# Altium project FIT_TCM.PrjPcb (part 4 of 9)

## Sheet FIT_TCM_P1V8.SchDoc: FIT_PM12 board
size 420 x 297 mm; CheckedBy: G.Kasprowicz; Author: INR Moscow; CompanyName: WUT ISE; DrawnBy: M.Podgórski; Organization: WUT ISE; Address1: PW ISE; Address2: Nowowiejska 15/19 00-665 Warsaw; Address3: gkasprow@gmail.com; Revision: 2; SheetNumber: -; SheetTotal: -; ModifiedBy: -; CheckedDate: -; Title2: Title 2; DivGrp: WUT ISE; Designer: INR RAS; ModifiedDate: -; ProjectName: Sensor Box
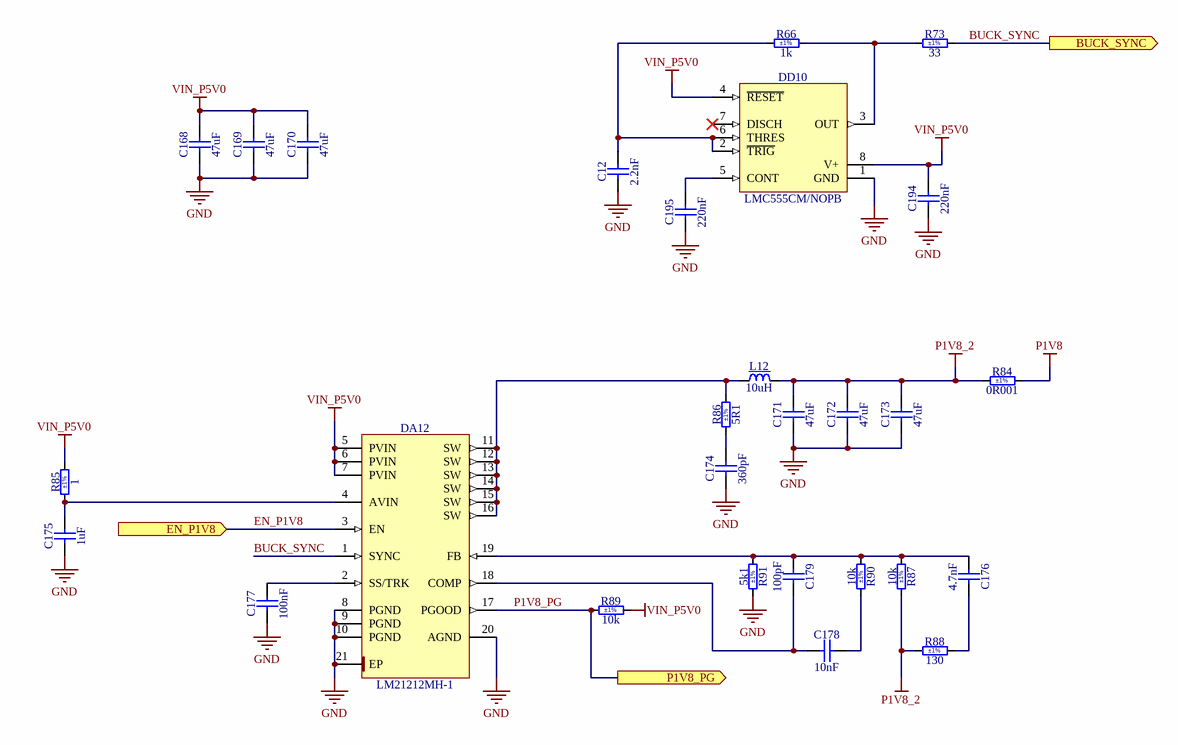
[diagram p9: FIT_TCM_P1V8.SchDoc]

### Parts
C12  2.2nF  [CAPC2013X100N]
C168  47uF  [CAPC3225X270N]
C169  47uF  [CAPC3225X270N]
C170  47uF  [CAPC3225X270N]
C171  47uF  [CAPC3225X270N]
C172  47uF  [CAPC3225X270N]
C173  47uF  [CAPC3225X270N]
C174  360pF  [CAPC2013X145N]
C175  1uF  [CAPC2012X140N]
C176  4.7nF  [CAPC2012X95N]
C177  100nF  [CAPC2012X135N]
C178  10nF  [CAPC2012X135N]
C179  100pF  [CAPC2012X135N]
C194  220nF  [CAPC2012X135N]
C195  220nF  [CAPC2012X135N]
DA12  LM21212MH-1  [TEXAS_PWP0020AA]
DD10  LMC555CM/NOPB  [SOIC127P600X175-8N]
L12  10uH  [IND_VISHAY_IHPL4040DZ-01]
R66  1k  Tolerance: ±1%  [RESC2012X60N]
R73  33  Tolerance: ±1%  [RESC2012X60N]
R84  0R001  Tolerance: ±1%  [RESC_BOURNS_CRE2512_0R001-0R004]
R85  1  Tolerance: ±1%  [RESC2012X60N]
R86  5R1  Tolerance: ±1%  [RESC2012X60N]
R87  10k  Tolerance: ±1%  [RESC2012X60N]
R88  130  Tolerance: ±1%  [RESC2012X60N]
R89  10k  Tolerance: ±1%  [RESC2012X60N]
R90  10k  Tolerance: ±1%  [RESC2012X60N]
R91  5k1  Tolerance: ±1%  [RESC2012X60N]

### Ports
BUCK_SYNC (out), EN_P1V8 (in), P1V8_PG (out)

### Nets
GND: C12.1 C168.1 C169.1 C170.1 C171.1 C172.1 C173.1 C174.1 C175.1 C177.1 C194.1 C195.1 DA12.8(PGND) DA12.9(PGND) DA12.10(PGND) DA12.20(AGND) DA12.21(EP) DD10.1(GND) R91.1
P1V8: R84.2
P1V8_2: C171.2 C172.2 C173.2 L12.2 R84.1 R87.1 R88.2
VIN_P5V0: C168.2 C169.2 C170.2 C194.2 DA12.5(PVIN) DA12.6(PVIN) DA12.7(PVIN) DD10.4(~{RESET}) DD10.8(V+) R85.2 R89.2
BUCK_SYNC: DA12.1(SYNC) R73.2 ; port BUCK_SYNC
EN_P1V8: DA12.3(EN) ; port EN_P1V8
P1V8_PG: DA12.17(PGOOD) R89.1 ; port P1V8_PG
NetC12_2: C12.2 DD10.2(~{TRIG}) DD10.6(THRES) R66.1
NetC174_2: C174.2 R86.1
NetC175_2: C175.2 DA12.4(AVIN) R85.1
NetC176_1: C176.1 R88.1
NetC176_2: C176.2 C179.2 DA12.19(FB) R87.2 R90.2 R91.2
NetC177_2: C177.2 DA12.2(SS/TRK)
NetC178_1: C178.1 R90.1
NetC178_2: C178.2 C179.1 DA12.18(COMP)
NetC195_2: C195.2 DD10.5(CONT)
NetDA12_11: DA12.11(SW) DA12.12(SW) DA12.13(SW) DA12.14(SW) DA12.15(SW) DA12.16(SW) L12.1 R86.2
NetDD10_3: DD10.3(OUT) R66.2 R73.1

Not connected (* = marked no-connect by the designer): DD10 7(DISCH)*

### Notes on the sheet
- Project/Equipment
- Document
- Designer
- Drawn by
- Check.by
- Copyright WUT ISE 2024.
  This documentation describes Open Hardware and is licensed under the CERN OHL v.2. You may redistribute and modify this documentation under the terms of the CERN OHL v.2. (http://ohwr.org/CERNOHL). This documentation is distributed WITHOUT ANY EXPRESS OR IMPLIED WARRANTY, INCLUDING OF MERCHANTABILITY, SATISFACTORY QUALITY AND FITNESS FOR A PARTICULAR PURPOSE. Please see the CERN OHL v.2 for applicable conditions.
- Contact
- File
- Last Mod.
- Print Date
- Sheet
- Size
- A3
- of
- Rev

### Library data of the parts
C12 = CC0805_2.2NF_50V_5%_C0G: Non-polarised capacitor; Part Description: SMD Multilayer Chip Ceramic Capacitor; Manufacturer: GENERIC; Manufacturer1 Part Number: C0805C222J5GACTU; Voltage: 50V; TC: C0G/NP0; Tolerance: ±5%; Part Number: CC0805_2.2NF_50V_5%_C0G; Component Kind: Standard; Component Type: Standard; Pin Count: 2; Value: 2.2nF; Status: None; Manufacturer Part Number: CC0805_2.2NF_50V_5%_C0G; Case: 0805; Mounted: Yes; Socket: No; SMD: Yes; Sense: No; Manufacturer1 Example: KEMET; Manufacturer1 ComponentHeight: 0.88mm; HelpURL: \\cern.ch\dfs\Applications\Altium\Datasheets\CC0805_C0G_KEMET_(Commercial Grade).pdf; Author: CERN DEM MR; CreateDate: 26.01.2016; LatestRevisionDate: 26.01.2016
C168-C173 = CC1210_47UF_16V_20%_X5R: Non-polarised capacitor; Part Description: SMD Multilayer Chip Ceramic Capacitor; Manufacturer: GENERIC; Manufacturer1 Part Number: EMK325BJ476MM-T; Voltage: 16V; TC: X5R; Tolerance: ±20%; Part Number: CC1210_47UF_16V_20%_X5R; Component Kind: Standard; Component Type: Standard; Pin Count: 2; Value: 47uF; Status: None; Manufacturer Part Number: CC1210_47UF_16V_20%_X5R; Case: 1210; Mounted: Yes; Socket: No; SMD: Yes; Sense: No; Manufacturer1 Example: TAIYO YUDEN; Manufacturer1 ComponentHeight: 2.7mm; HelpURL: \\cern.ch\dfs\Applications\Altium\Datasheets\CC1210_X5R_TAIYO-YUDEN_HIGH-VALUE.pdf; Author: CERN DEM MR; CreateDate: 03.02.2016; LatestRevisionDate: 03.02.2016
C174 = CC0805_360PF_50V_5%_C0G: Non-polarised capacitor; Part Description: SMD Multilayer Chip Ceramic Capacitor; Manufacturer: GENERIC; Manufacturer1 Part Number: CC0805JRNPO9BN361; Voltage: 50V; TC: NP0; Tolerance: ±5%; Part Number: CC0805_360PF_50V_5%_C0G; Component Kind: Standard; Component Type: Standard; Pin Count: 2; Value: 360pF; Status: None; Manufacturer Part Number: CC0805_360PF_50V_5%_C0G; Case: 0805; Mounted: Yes; Socket: No; SMD: Yes; Sense: No; Manufacturer1 Example: YAGEO PHYCOMP; Manufacturer1 ComponentHeight: 1.45mm; HelpURL: \\cern.ch\dfs\Applications\Altium\Datasheets\CC0805_NP0_YAGEO.pdf; Author: CERN DEM HF; CreateDate: 30.05.2024; LatestRevisionDate: 30.05.2024
C175 = CC0805_1UF_25V_10%_X7R: Non-polarised capacitor; Part Description: SMD Multilayer Chip Ceramic Capacitor; Manufacturer: GENERIC; Manufacturer1 Part Number: C0805C105K3RAC; Voltage: 25V; TC: X7R; Tolerance: ±10%; Part Number: CC0805_1UF_25V_10%_X7R; Component Kind: Standard; Component Type: Standard; Pin Count: 2; Value: 1uF; Status: Preferred; Manufacturer Part Number: CC0805_1UF_25V_10%_X7R; Case: 0805; Mounted: Yes; Socket: No; SMD: Yes; Sense: No; Manufacturer1 Example: KEMET; Manufacturer1 ComponentHeight: 1.4mm; HelpURL: \\cern.ch\dfs\Applications\Altium\Datasheets\CC0805_X7R_KEMET.pdf; Author: CERN DEM JLC; CreateDate: 23.03.2009; LatestRevisionDate: 23.03.2009
C176 = CC0805_4.7NF_50V_5%_NP0: Non-polarised capacitor; Part Description: SMD Multilayer Chip Ceramic Capacitor; Manufacturer: GENERIC; Manufacturer1 Part Number: GRM2195C1H472JA01; Voltage: 50V; TC: C0G/NP0; Tolerance: ±5%; Part Number: CC0805_4.7NF_50V_5%_NP0; Component Kind: Standard; Component Type: Standard; Pin Count: 2; Value: 4.7nF; Status: None; Manufacturer Part Number: CC0805_4.7NF_50V_5%_NP0; Case: 0805; Mounted: Yes; Socket: No; SMD: Yes; Sense: No; Manufacturer1 Example: MURATA; Manufacturer1 ComponentHeight: 0.95mm; HelpURL: \\cern.ch\dfs\Applications\Altium\Datasheets\CC0805_MURATA_GRM2195C1H472JA01.pdf; Author: CERN DEM MR; CreateDate: 30.03.2016; LatestRevisionDate: 30.03.2016
C177 = CC0805_100NF_50V_10%_X7R: Non-polarised capacitor; Part Description: SMD Multilayer Chip Ceramic Capacitor; Manufacturer: GENERIC; Manufacturer1 Part Number: C2012X7R1H104K085; Voltage: 50V; TC: X7R; Tolerance: ±10%; Part Number: CC0805_100NF_50V_10%_X7R; Component Kind: Standard; Component Type: Standard; Pin Count: 2; Value: 100nF; Status: None; Manufacturer Part Number: CC0805_100NF_50V_10%_X7R; Case: 0805; Mounted: Yes; Socket: No; SMD: Yes; Sense: No; Manufacturer1 Example: TDK; Manufacturer1 ComponentHeight: 1mm; HelpURL: \\cern.ch\dfs\Applications\Altium\Datasheets\CC0805_X7R_TDK_C.pdf; Author: CERN DEM JLC; CreateDate: 03.12.2007; LatestRevisionDate: 22.04.2015
C178 = CC0805_10NF_50V_10%_X7R: Non-polarised capacitor; Part Description: SMD Multilayer Chip Ceramic Capacitor; Manufacturer: GENERIC; Manufacturer1 Part Number: C0805C103K5RACTU; Voltage: 50V; TC: X7R; Tolerance: ±10%; Part Number: CC0805_10NF_50V_10%_X7R; Component Kind: Standard; Component Type: Standard; Pin Count: 2; Value: 10nF; Status: Preferred; Manufacturer Part Number: CC0805_10NF_50V_10%_X7R; Case: 0805; Mounted: Yes; Socket: No; SMD: Yes; Sense: No; Manufacturer1 Example: KEMET; Manufacturer1 ComponentHeight: 0.88mm; HelpURL: \\cern.ch\dfs\Applications\Altium\Datasheets\CC0805_X7R_KEMET.pdf; Author: CERN DEM JLC; CreateDate: 03.12.2007; LatestRevisionDate: 22.04.2015
C179 = CC0805_100PF_50V_5%_NP0: Non-polarised capacitor; Part Description: SMD Multilayer Chip Ceramic Capacitor; Manufacturer: GENERIC; Manufacturer1 Part Number: 223886115101; Voltage: 50V; TC: C0G/NP0; Tolerance: ±5%; Part Number: CC0805_100PF_50V_5%_NP0; Component Kind: Standard; Component Type: Standard; Pin Count: 2; Value: 100pF; Status: Preferred; Manufacturer Part Number: CC0805_100PF_50V_5%_NP0; Case: 0805; Mounted: Yes; Socket: No; SMD: Yes; Sense: No; Manufacturer1 Example: PHYCOMP; Manufacturer1 ComponentHeight: 1.35mm; HelpURL: \\cern.ch\dfs\Applications\Altium\Datasheets\CC0805_NP0_PHYCOMP.pdf; Author: CERN DEM JLC; CreateDate: 03.12.2007; LatestRevisionDate: 03.12.2007
C194 C195 = CC0805_220NF_50V_10%_X7R: as C31-C35 on sheet FIT_TCM_SI5338A; Part Number: CC0805_220NF_50V_10%_X7R; Component Kind: Standard; Component Type: Standard; Pin Count: 2; Value: 220nF; Status: Preferred; Manufacturer Part Number: CC0805_220NF_50V_10%_X7R; Case: 0805; Mounted: Yes; Socket: No; SMD: Yes; Sense: No; Manufacturer1 Example: MURATA; Manufacturer1 ComponentHeight: 1.35mm; HelpURL: \\cern.ch\dfs\Applications\Altium\Datasheets\CC0805_X7R_MURATA.pdf; Author: CERN DEM JLC; CreateDate: 03.12.2007; LatestRevisionDate: 03.12.2007
DA12 = LM21212MH-1: 2.95-V To 5.5-V, 12-A, Voltage-Mode Synchronous Buck Regulator with Frequency Synchronization; Manufacturer: TEXAS INSTRUMENTS; PressFit: No; Bonding: No; Part Number: LM21212MH-1; Component Kind: Standard; Component Type: Standard; Device: LM21212MH-1; PackageDescription: TEXAS Case Style PWP0020AA, SOP, 0.65mm Pitch; 20 Pin, 4.40mm W X 6.50mm L X 1.10mm H body (w/thermal tab 3.4mm X 4.6mm  ), IPC Medium Density; Part Description: 2.95-V To 5.5-V, 12-A, Voltage-Mode Synchronous Buck Regulator with Frequency Synchronization; Manufacturer Part Number: LM21212MH-1; Pin Count: 21; Case: TSSOP20; Mounted: Yes; Socket: No; SMD: Yes; Sense: No; ComponentHeight: 1.1mm; HelpURL: \\cern.ch\dfs\Applications\Altium\Datasheets\LM21212MH-1.pdf; Author: CERN DEM HF; CreateDate: 05.06.2024; LatestRevisionDate: 05.06.2024
DD10 = LMC555CM/NOPB: CMOS Timer; Manufacturer: NATIONAL SEMICONDUCTOR; PressFit: No; Bonding: No; Part Number: LMC555CM/NOPB; Component Kind: Standard; Component Type: Standard; Device: LMC555CM/NOPB; PackageDescription: SOIC 8, Pitch 1.27mm, Body 4x5mm, IPC Medium Density; Part Description: CMOS Timer; Manufacturer Part Number: LMC555CM; Pin Count: 8; Case: SOIC8; Mounted: Yes; Socket: No; SMD: Yes; Sense: No; ComponentHeight: 1.75mm; Author: CERN DEM JLC; HelpURL: \\cern.ch\dfs\Applications\Altium\Datasheets\LMC555C-NOPB.pdf; CreateDate: 12.04.2010; LatestRevisionDate: 01.06.2022
L12 = IND4040_10UH_20%_VISHAY_IHLP-4040DZ-01: Inductor With Core; Part Description: IHLP® Commercial Inductor, Low DCR Series; Manufacturer: VISHAY DALE; Manufacturer Part Number: IHLP4040DZER100M01; Power: 6.8A; Resistance: 0.0332R; Tolerance: ±20%; Part Number: IND4040_10UH_20%_VISHAY_IHLP-4040DZ-01; Component Kind: Standard; Component Type: Standard; Pin Count: 2; Value: 10uH; Case: 4040; Mounted: Yes; Socket: No; SMD: Yes; Sense: No; ComponentHeight: 4mm; HelpURL: \\cern.ch\dfs\Applications\Altium\Datasheets\IND_VISHAY_IHLP4040DZ-01.pdf; Author: CERN DEM HF; CreateDate: 31.05.2024; LatestRevisionDate: 31.05.2024
R66 = R0805_1K_1%_0.125W_100PPM: Resistor - 1%; Part Description: General Purpose Thick Film Chip Resistor; Manufacturer: GENERIC; Manufacturer1 Part Number: NRC10F1001TRF; Power: 0.125W; TC: ±100ppm/°C; PressFit: No; Part Number: R0805_1K_1%_0.125W_100PPM; Component Kind: Standard; Component Type: Standard; Pin Count: 2; Value: 1k; Status: Preferred; Manufacturer Part Number: R0805_1K_1%_0.125W_100PPM; Case: 0805; Mounted: Yes; Sense: No; Socket: No; SMD: Yes; Manufacturer1 Example: NIC COMPONENT; Manufacturer1 ComponentHeight: 0.6mm; HelpURL: \\cern.ch\dfs\Applications\Altium\Datasheets\R0805_NIC_NRC.pdf; Author: CERN DEM JLC; CreateDate: 03.12.2007; LatestRevisionDate: 13.03.2008
R73 = R0805_33R_1%_0.125W_100PPM: Resistor - 1%; Part Description: General Purpose Thick Film Chip Resistor; Manufacturer: GENERIC; Manufacturer1 Part Number: NRC10F33R0TRF; Power: 0.125W; TC: ±100ppm/°C; PressFit: No; Part Number: R0805_33R_1%_0.125W_100PPM; Component Kind: Standard; Component Type: Standard; Pin Count: 2; Value: 33; Status: Preferred; Manufacturer Part Number: R0805_33R_1%_0.125W_100PPM; Case: 0805; Mounted: Yes; Sense: No; Socket: No; SMD: Yes; Manufacturer1 Example: NIC COMPONENT; Manufacturer1 ComponentHeight: 0.6mm; HelpURL: \\cern.ch\dfs\Applications\Altium\Datasheets\R0805_NIC_NRC.pdf; Author: CERN DEM JLC; CreateDate: 03.12.2007; LatestRevisionDate: 13.03.2008
R84 = R2512_0R001_1%_3W_50PPM_BOURNS_CRE2512: Resistor - 1%; Part Description: High Power Current Sense Chip Resistor; Manufacturer: BOURNS; Manufacturer Part Number: CRE2512-FZ-R001E-3; Power: 3W; TC: ±50ppm/°C; PressFit: No; Part Number: R2512_0R001_1%_3W_50PPM_BOURNS_CRE2512; Component Kind: Standard; Component Type: Standard; Pin Count: 2; Value: 0R001; Status: None; Case: 2512; Mounted: Yes; Sense: No; Socket: No; SMD: Yes; ComponentHeight: 0.9mm; HelpURL: \\cern.ch\dfs\Applications\Altium\Datasheets\R2512_BOURNS_CRE2512.pdf; Author: CERN DEM BC; CreateDate: 13.10.2021; LatestRevisionDate: 13.10.2021
R85 = R0805_1R_1%_0.125W_100PPM: Resistor - 1%; Part Description: Thick Film Chip Resistor; Manufacturer: GENERIC; Manufacturer1 Part Number: CRCW08051R00FKEA; Power: 0.125W; TC: ±100ppm/°C; PressFit: No; Part Number: R0805_1R_1%_0.125W_100PPM; Component Kind: Standard; Component Type: Standard; Pin Count: 2; Value: 1; Status: None; Manufacturer Part Number: R0805_1R_1%_0.125W_100PPM; Case: 0805; Mounted: Yes; Sense: No; Socket: No; SMD: Yes; Manufacturer1 Example: VISHAY; Manufacturer1 ComponentHeight: 0.6mm; HelpURL: \\cern.ch\dfs\Applications\Altium\Datasheets\R0805_VISHAY_CRCW e3.pdf; Author: CERN DEM HF; CreateDate: 07.06.2024; LatestRevisionDate: 07.06.2024
R86 = R0805_5R1_1%_0.125W_100PPM: Resistor - 1%; Part Description: Thick Film Chip Resistor; Manufacturer: GENERIC; Manufacturer1 Part Number: CRCW08055R10FKEAHP; Power: 0.125W; TC: ±100ppm/°C; PressFit: No; Part Number: R0805_5R1_1%_0.125W_100PPM; Component Kind: Standard; Component Type: Standard; Pin Count: 2; Value: 5R1; Status: None; Manufacturer Part Number: R0805_5R1_1%_0.125W_100PPM; Case: 0805; Mounted: Yes; Sense: No; Socket: No; SMD: Yes; Manufacturer1 Example: VISHAY; Manufacturer1 ComponentHeight: 0.6mm; HelpURL: \\cern.ch\dfs\Applications\Altium\Datasheets\R0805_VISHAY_CRCW-HP e3.pdf; Author: CERN DEM HF; CreateDate: 07.06.2024; LatestRevisionDate: 07.06.2024
R87 R89 R90 = R0805_10K_1%_0.125W_100PPM: Resistor - 1%; Part Description: General Purpose Thick Film Chip Resistor; Manufacturer: GENERIC; Manufacturer1 Part Number: NRC10F1002TRF; Power: 0.125W; TC: ±100ppm/°C; PressFit: No; Part Number: R0805_10K_1%_0.125W_100PPM; Component Kind: Standard; Component Type: Standard; Pin Count: 2; Value: 10k; Status: Preferred; Manufacturer Part Number: R0805_10K_1%_0.125W_100PPM; Case: 0805; Mounted: Yes; Sense: No; Socket: No; SMD: Yes; Manufacturer1 Example: NIC COMPONENT; Manufacturer1 ComponentHeight: 0.6mm; HelpURL: \\cern.ch\dfs\Applications\Altium\Datasheets\R0805_NIC_NRC.pdf; Author: CERN DEM JLC; CreateDate: 03.12.2007; LatestRevisionDate: 13.03.2008
R88 = R0805_130R_1%_0.125W_100PPM: Resistor - 1%; Part Description: General Purpose Thick Film Chip Resistor; Manufacturer: GENERIC; Manufacturer1 Part Number: NRC10F1300TRF; Power: 0.125W; TC: ±100ppm/°C; PressFit: No; Part Number: R0805_130R_1%_0.125W_100PPM; Component Kind: Standard; Component Type: Standard; Pin Count: 2; Value: 130; Status: Preferred; Manufacturer Part Number: R0805_130R_1%_0.125W_100PPM; Case: 0805; Mounted: Yes; Sense: No; Socket: No; SMD: Yes; Manufacturer1 Example: NIC COMPONENT; Manufacturer1 ComponentHeight: 0.6mm; HelpURL: \\cern.ch\dfs\Applications\Altium\Datasheets\R0805_NIC_NRC.pdf; Author: CERN DEM JLC; CreateDate: 03.12.2007; LatestRevisionDate: 13.03.2008
R91 = R0805_5K1_1%_0.125W_100PPM: Resistor - 1%; Part Description: General Purpose Thick Film Chip Resistor; Manufacturer: GENERIC; Manufacturer1 Part Number: NRC10F5101TRF; Power: 0.125W; TC: ±100ppm/°C; PressFit: No; Part Number: R0805_5K1_1%_0.125W_100PPM; Component Kind: Standard; Component Type: Standard; Pin Count: 2; Value: 5k1; Status: Preferred; Manufacturer Part Number: R0805_5K1_1%_0.125W_100PPM; Case: 0805; Mounted: Yes; Sense: No; Socket: No; SMD: Yes; Manufacturer1 Example: NIC COMPONENT; Manufacturer1 ComponentHeight: 0.6mm; HelpURL: \\cern.ch\dfs\Applications\Altium\Datasheets\R0805_NIC_NRC.pdf; Author: CERN DEM JLC; CreateDate: 03.12.2007; LatestRevisionDate: 13.03.2008

## Sheet FIT_TCM_P3V3.SchDoc: FIT_PM12 board
size 420 x 297 mm; CheckedBy: G.Kasprowicz; Author: INR Moscow; CompanyName: WUT ISE; DrawnBy: M.Podgórski; Organization: WUT ISE; Address1: PW ISE; Address2: Nowowiejska 15/19 00-665 Warsaw; Address3: gkasprow@gmail.com; Revision: 2; SheetNumber: -; SheetTotal: -; ModifiedBy: -; CheckedDate: -; Title2: Title 2; DivGrp: WUT ISE; Designer: INR RAS; ModifiedDate: -; ProjectName: Sensor Box
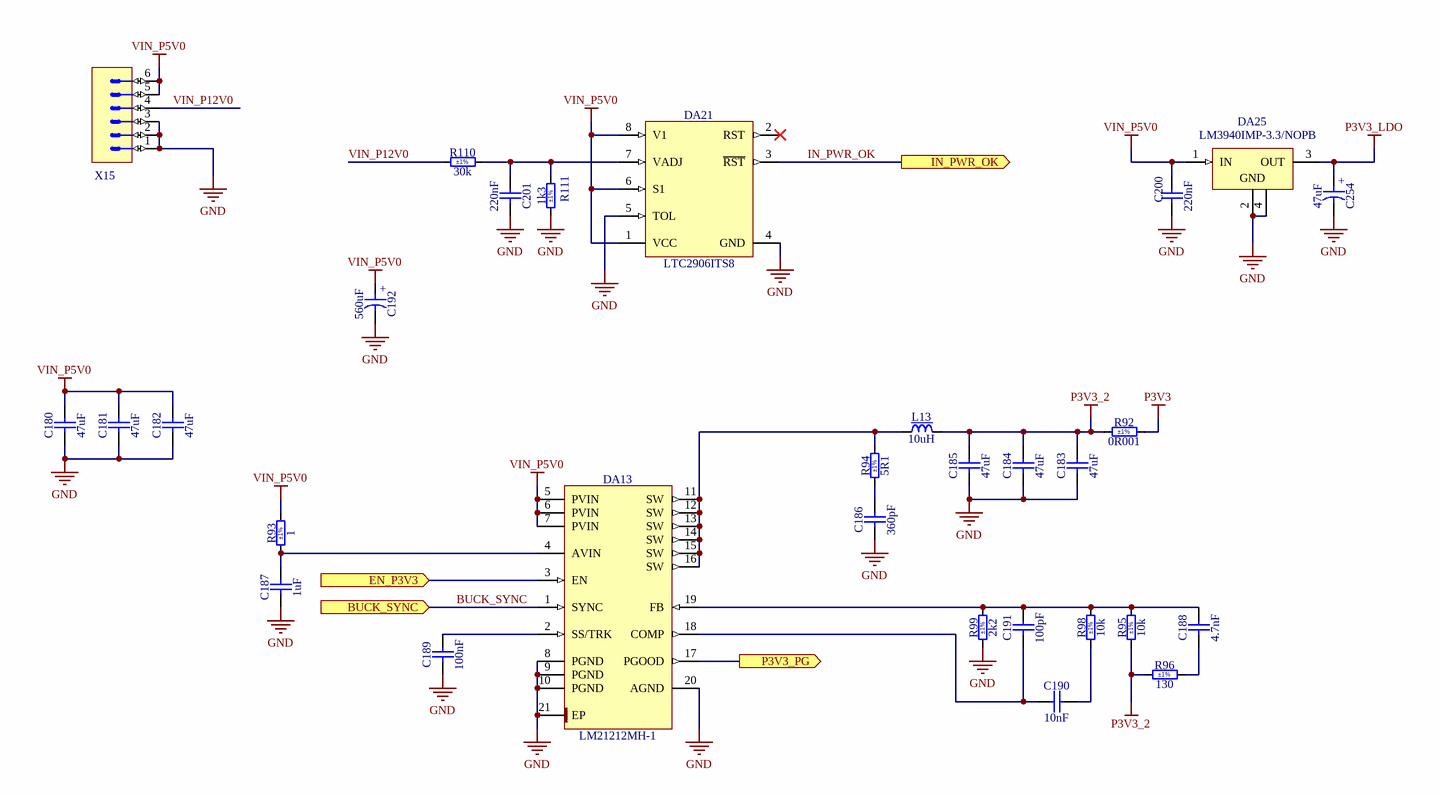
[diagram p10: FIT_TCM_P3V3.SchDoc]

### Parts
C180  47uF  [CAPC3225X270N]
C181  47uF  [CAPC3225X270N]
C182  47uF  [CAPC3225X270N]
C183  47uF  [CAPC3225X270N]
C184  47uF  [CAPC3225X270N]
C185  47uF  [CAPC3225X270N]
C186  360pF  [CAPC2013X145N]
C187  1uF  [CAPC2012X140N]
C188  4.7nF  [CAPC2012X95N]
C189  100nF  [CAPC2012X135N]
C190  10nF  [CAPC2012X135N]
C191  100pF  [CAPC2012X135N]
C192  560uF  [CAPAE830X1020N]
C200  220nF  [CAPC2012X135N]
C201  220nF  [CAPC2012X135N]
C254  47uF  [CAPAE530X610N]
DA13  LM21212MH-1  [TEXAS_PWP0020AA]
DA21  LTC2906ITS8  [SOT65P280X100-8N]
DA25  LM3940IMP-3.3/NOPB  [SOT230P700X180-4N]
L13  10uH  [IND_VISHAY_IHPL4040DZ-01]
R92  0R001  Tolerance: ±1%  [RESC_BOURNS_CRE2512_0R001-0R004]
R93  1  Tolerance: ±1%  [RESC2012X60N]
R94  5R1  Tolerance: ±1%  [RESC2012X60N]
R95  10k  Tolerance: ±1%  [RESC2012X60N]
R96  130  Tolerance: ±1%  [RESC2012X60N]
R98  10k  Tolerance: ±1%  [RESC2012X60N]
R99  2k2  Tolerance: ±1%  [RESC2012X60N]
R110  30k  Tolerance: ±1%  [RESC2012X60N]
R111  1k3  Tolerance: ±1%  [RESC2012X60N]
X15  Mini-Fit BMI  [MOLEX_15-24-9067]  (value not drawn)

### Ports
BUCK_SYNC (in), EN_P3V3 (in), IN_PWR_OK (out), P3V3_PG (out)

### Nets
GND: C180.1 C181.1 C182.1 C183.1 C184.1 C185.1 C186.1 C187.1 C189.1 C192.2 C200.1 C201.1 C254.2 DA13.8(PGND) DA13.9(PGND) DA13.10(PGND) DA13.20(AGND) DA13.21(EP) DA21.4(GND) DA21.5(TOL) DA25.2(GND) DA25.4(GND) R99.1 R111.1 X15.1 X15.2 X15.3
P3V3: R92.2
P3V3_2: C183.2 C184.2 C185.2 L13.2 R92.1 R95.1 R96.2
P3V3_LDO: C254.1 DA25.3(OUT)
VIN_P5V0: C180.2 C181.2 C182.2 C192.1 C200.2 DA13.5(PVIN) DA13.6(PVIN) DA13.7(PVIN) DA21.1(VCC) DA21.6(S1) DA21.8(V1) DA25.1(IN) R93.2 X15.5 X15.6
BUCK_SYNC: DA13.1(SYNC) ; port BUCK_SYNC
EN_P1V0LDO_P3V3: DA13.3(EN) ; port EN_P3V3
IN_PWR_OK: DA21.3(~{RST}) ; port IN_PWR_OK
P1V0LDO_P3V3_PG: DA13.17(PGOOD) ; port P3V3_PG
VIN_P12V0: R110.2 X15.4
NetC186_2: C186.2 R94.1
NetC187_2: C187.2 DA13.4(AVIN) R93.1
NetC188_1: C188.1 R96.1
NetC188_2: C188.2 C191.2 DA13.19(FB) R95.2 R98.2 R99.2
NetC189_2: C189.2 DA13.2(SS/TRK)
NetC190_1: C190.1 R98.1
NetC190_2: C190.2 C191.1 DA13.18(COMP)
NetC201_2: C201.2 DA21.7(VADJ) R110.1 R111.2
NetDA13_11: DA13.11(SW) DA13.12(SW) DA13.13(SW) DA13.14(SW) DA13.15(SW) DA13.16(SW) L13.1 R94.2

Not connected (* = marked no-connect by the designer): DA21 2(RST)*

### Notes on the sheet
- Project/Equipment
- Document
- Designer
- Drawn by
- Check.by
- Copyright WUT ISE 2024.
  This documentation describes Open Hardware and is licensed under the CERN OHL v.2. You may redistribute and modify this documentation under the terms of the CERN OHL v.2. (http://ohwr.org/CERNOHL). This documentation is distributed WITHOUT ANY EXPRESS OR IMPLIED WARRANTY, INCLUDING OF MERCHANTABILITY, SATISFACTORY QUALITY AND FITNESS FOR A PARTICULAR PURPOSE. Please see the CERN OHL v.2 for applicable conditions.
- Contact
- File
- Last Mod.
- Print Date
- Sheet
- Size
- A3
- of
- Rev
- (in symbol CAE530-610_47UF_16V_20%) +
- (in symbol CAE830-1020_560UF_10V_20%) +

### Library data of the parts
C180-C185 = CC1210_47UF_16V_20%_X5R: as C168 on sheet FIT_TCM_P1V8; Part Number: CC1210_47UF_16V_20%_X5R; Component Kind: Standard; Component Type: Standard; Pin Count: 2; Value: 47uF; Status: None; Manufacturer Part Number: CC1210_47UF_16V_20%_X5R; Case: 1210; Mounted: Yes; Socket: No; SMD: Yes; Sense: No; Manufacturer1 Example: TAIYO YUDEN; Manufacturer1 ComponentHeight: 2.7mm; HelpURL: \\cern.ch\dfs\Applications\Altium\Datasheets\CC1210_X5R_TAIYO-YUDEN_HIGH-VALUE.pdf; Author: CERN DEM MR; CreateDate: 03.02.2016; LatestRevisionDate: 03.02.2016
C186 = CC0805_360PF_50V_5%_C0G: as C174 on sheet FIT_TCM_P1V8; Part Number: CC0805_360PF_50V_5%_C0G; Component Kind: Standard; Component Type: Standard; Pin Count: 2; Value: 360pF; Status: None; Manufacturer Part Number: CC0805_360PF_50V_5%_C0G; Case: 0805; Mounted: Yes; Socket: No; SMD: Yes; Sense: No; Manufacturer1 Example: YAGEO PHYCOMP; Manufacturer1 ComponentHeight: 1.45mm; HelpURL: \\cern.ch\dfs\Applications\Altium\Datasheets\CC0805_NP0_YAGEO.pdf; Author: CERN DEM HF; CreateDate: 30.05.2024; LatestRevisionDate: 30.05.2024
C187 = CC0805_1UF_25V_10%_X7R: as C175 on sheet FIT_TCM_P1V8; Part Number: CC0805_1UF_25V_10%_X7R; Component Kind: Standard; Component Type: Standard; Pin Count: 2; Value: 1uF; Status: Preferred; Manufacturer Part Number: CC0805_1UF_25V_10%_X7R; Case: 0805; Mounted: Yes; Socket: No; SMD: Yes; Sense: No; Manufacturer1 Example: KEMET; Manufacturer1 ComponentHeight: 1.4mm; HelpURL: \\cern.ch\dfs\Applications\Altium\Datasheets\CC0805_X7R_KEMET.pdf; Author: CERN DEM JLC; CreateDate: 23.03.2009; LatestRevisionDate: 23.03.2009
C188 = CC0805_4.7NF_50V_5%_NP0: as C176 on sheet FIT_TCM_P1V8; Part Number: CC0805_4.7NF_50V_5%_NP0; Component Kind: Standard; Component Type: Standard; Pin Count: 2; Value: 4.7nF; Status: None; Manufacturer Part Number: CC0805_4.7NF_50V_5%_NP0; Case: 0805; Mounted: Yes; Socket: No; SMD: Yes; Sense: No; Manufacturer1 Example: MURATA; Manufacturer1 ComponentHeight: 0.95mm; HelpURL: \\cern.ch\dfs\Applications\Altium\Datasheets\CC0805_MURATA_GRM2195C1H472JA01.pdf; Author: CERN DEM MR; CreateDate: 30.03.2016; LatestRevisionDate: 30.03.2016
C189 = CC0805_100NF_50V_10%_X7R: as C177 on sheet FIT_TCM_P1V8; Part Number: CC0805_100NF_50V_10%_X7R; Component Kind: Standard; Component Type: Standard; Pin Count: 2; Value: 100nF; Status: None; Manufacturer Part Number: CC0805_100NF_50V_10%_X7R; Case: 0805; Mounted: Yes; Socket: No; SMD: Yes; Sense: No; Manufacturer1 Example: TDK; Manufacturer1 ComponentHeight: 1mm; HelpURL: \\cern.ch\dfs\Applications\Altium\Datasheets\CC0805_X7R_TDK_C.pdf; Author: CERN DEM JLC; CreateDate: 03.12.2007; LatestRevisionDate: 22.04.2015
C190 = CC0805_10NF_50V_10%_X7R: as C178 on sheet FIT_TCM_P1V8; Part Number: CC0805_10NF_50V_10%_X7R; Component Kind: Standard; Component Type: Standard; Pin Count: 2; Value: 10nF; Status: Preferred; Manufacturer Part Number: CC0805_10NF_50V_10%_X7R; Case: 0805; Mounted: Yes; Socket: No; SMD: Yes; Sense: No; Manufacturer1 Example: KEMET; Manufacturer1 ComponentHeight: 0.88mm; HelpURL: \\cern.ch\dfs\Applications\Altium\Datasheets\CC0805_X7R_KEMET.pdf; Author: CERN DEM JLC; CreateDate: 03.12.2007; LatestRevisionDate: 22.04.2015
C191 = CC0805_100PF_50V_5%_NP0: as C179 on sheet FIT_TCM_P1V8; Part Number: CC0805_100PF_50V_5%_NP0; Component Kind: Standard; Component Type: Standard; Pin Count: 2; Value: 100pF; Status: Preferred; Manufacturer Part Number: CC0805_100PF_50V_5%_NP0; Case: 0805; Mounted: Yes; Socket: No; SMD: Yes; Sense: No; Manufacturer1 Example: PHYCOMP; Manufacturer1 ComponentHeight: 1.35mm; HelpURL: \\cern.ch\dfs\Applications\Altium\Datasheets\CC0805_NP0_PHYCOMP.pdf; Author: CERN DEM JLC; CreateDate: 03.12.2007; LatestRevisionDate: 03.12.2007
C192 = CAE830-1020_560UF_10V_20%: Polarised capacitor; Part Description: Aluminum Electrolytic SMT Capacitor; Manufacturer: PANASONIC; Manufacturer Part Number: EEEFH1A561L; Voltage: 10V; Tolerance: ±20%; Part Number: CAE830-1020_560UF_10V_20%; Component Kind: Standard; Component Type: Standard; Pin Count: 2; Value: 560uF; Status: Not Recommended; Case: F; Mounted: Yes; Socket: No; SMD: Yes; Sense: No; ComponentHeight: 10.2mm; HelpURL: \\cern.ch\dfs\Applications\Altium\Datasheets\CAE_PANASONIC_FH.pdf; Author: CERN DEM HF; CreateDate: 24.05.2024; LatestRevisionDate: 24.05.2024
C200 C201 = CC0805_220NF_50V_10%_X7R: as C31-C35 on sheet FIT_TCM_SI5338A; Part Number: CC0805_220NF_50V_10%_X7R; Component Kind: Standard; Component Type: Standard; Pin Count: 2; Value: 220nF; Status: Preferred; Manufacturer Part Number: CC0805_220NF_50V_10%_X7R; Case: 0805; Mounted: Yes; Socket: No; SMD: Yes; Sense: No; Manufacturer1 Example: MURATA; Manufacturer1 ComponentHeight: 1.35mm; HelpURL: \\cern.ch\dfs\Applications\Altium\Datasheets\CC0805_X7R_MURATA.pdf; Author: CERN DEM JLC; CreateDate: 03.12.2007; LatestRevisionDate: 03.12.2007
C254 = CAE530-610_47UF_16V_20%: Polarised capacitor; Part Description: Conductive Polymer Hybrid Aluminum Electrolytic Capacitor; Manufacturer: CHEMI-CON; Manufacturer Part Number: HHXD160ARA470ME61G; Voltage: 16V; Tolerance: ±20%; Part Number: CAE530-610_47UF_16V_20%; Component Kind: Standard; Component Type: Standard; Pin Count: 2; Value: 47uF; Status: Not Recommended; Case: C; Mounted: Yes; Socket: No; SMD: Yes; Sense: No; ComponentHeight: 6.1mm; HelpURL: \\cern.ch\dfs\Applications\Altium\Datasheets\CAE_CHIMI-CON_HXD.pdf; Author: CERN DEM HF; CreateDate: 15.04.2024; LatestRevisionDate: 15.04.2024
DA13 = LM21212MH-1: as DA12 on sheet FIT_TCM_P1V8; Part Number: LM21212MH-1; Component Kind: Standard; Component Type: Standard; Device: LM21212MH-1; PackageDescription: TEXAS Case Style PWP0020AA, SOP, 0.65mm Pitch; 20 Pin, 4.40mm W X 6.50mm L X 1.10mm H body (w/thermal tab 3.4mm X 4.6mm  ), IPC Medium Density; Part Description: 2.95-V To 5.5-V, 12-A, Voltage-Mode Synchronous Buck Regulator with Frequency Synchronization; Manufacturer Part Number: LM21212MH-1; Pin Count: 21; Case: TSSOP20; Mounted: Yes; Socket: No; SMD: Yes; Sense: No; ComponentHeight: 1.1mm; HelpURL: \\cern.ch\dfs\Applications\Altium\Datasheets\LM21212MH-1.pdf; Author: CERN DEM HF; CreateDate: 05.06.2024; LatestRevisionDate: 05.06.2024
DA21 = LTC2906ITS8: Precision Dual Supply Monitors with One Pin-Selectable Threshold and One Adjustable Input; Manufacturer: LINEAR TECHNOLOGY; PressFit: No; Bonding: No; Part Number: LTC2906ITS8; Component Kind: Standard; Component Type: Standard; Device: LTC2906ITS8; PackageDescription: SOT, 0.65mm Pitch; 8 Pin, 1.625mm W X 2.90mm L X 1.00mm H Body, IPC Medium Density; Part Description: Precision Dual Supply Monitors with One Pin-Selectable Threshold and One Adjustable Input; Manufacturer Part Number: LTC2906ITS8; Pin Count: 8; Case: SOT23-8; Mounted: Yes; Socket: No; SMD: Yes; Sense: No; ComponentHeight: 1mm; Author: CERN DEM HF; HelpURL: \\cern.ch\dfs\Applications\Altium\Datasheets\LTC2906.pdf; CreateDate: 05.06.2024; LatestRevisionDate: 05.06.2024
DA25 = LM3940IMP-3.3/NOPB: 3-Terminal Regulator 1=IN 2=GND 3=OUT 4=GND; Part Description: 1A Low Dropout Regulator for 5V to 3.3V Conversion; Manufacturer: TEXAS INSTRUMENTS; PressFit: No; Bonding: No; Part Number: LM3940IMP-3.3/NOPB; Component Kind: Standard; Component Type: Standard; Device: LM3940IMP-3.3/NOPB; PackageDescription: SOT223, 2.30mm Pitch; 4 Pin, 3.70mm W X 6.70mm L X 1.80mm H body, IPC Medium Density; Manufacturer Part Number: LM3940IMP-3.3; Pin Count: 4; Case: SOT223; Mounted: Yes; Socket: No; SMD: Yes; Sense: No; ComponentHeight: 1.8mm; HelpURL: \\cern.ch\dfs\Applications\Altium\Datasheets\LM3940IMP-3.3-NOPB.pdf; Author: CERN DEM JLC; CreateDate: 28.03.2011; LatestRevisionDate: 01.06.2022
L13 = IND4040_10UH_20%_VISHAY_IHLP-4040DZ-01: as L12 on sheet FIT_TCM_P1V8; Part Number: IND4040_10UH_20%_VISHAY_IHLP-4040DZ-01; Component Kind: Standard; Component Type: Standard; Pin Count: 2; Value: 10uH; Case: 4040; Mounted: Yes; Socket: No; SMD: Yes; Sense: No; ComponentHeight: 4mm; HelpURL: \\cern.ch\dfs\Applications\Altium\Datasheets\IND_VISHAY_IHLP4040DZ-01.pdf; Author: CERN DEM HF; CreateDate: 31.05.2024; LatestRevisionDate: 31.05.2024
R92 = R2512_0R001_1%_3W_50PPM_BOURNS_CRE2512: as R84 on sheet FIT_TCM_P1V8; Part Number: R2512_0R001_1%_3W_50PPM_BOURNS_CRE2512; Component Kind: Standard; Component Type: Standard; Pin Count: 2; Value: 0R001; Status: None; Case: 2512; Mounted: Yes; Sense: No; Socket: No; SMD: Yes; ComponentHeight: 0.9mm; HelpURL: \\cern.ch\dfs\Applications\Altium\Datasheets\R2512_BOURNS_CRE2512.pdf; Author: CERN DEM BC; CreateDate: 13.10.2021; LatestRevisionDate: 13.10.2021
R93 = R0805_1R_1%_0.125W_100PPM: as R85 on sheet FIT_TCM_P1V8; Part Number: R0805_1R_1%_0.125W_100PPM; Component Kind: Standard; Component Type: Standard; Pin Count: 2; Value: 1; Status: None; Manufacturer Part Number: R0805_1R_1%_0.125W_100PPM; Case: 0805; Mounted: Yes; Sense: No; Socket: No; SMD: Yes; Manufacturer1 Example: VISHAY; Manufacturer1 ComponentHeight: 0.6mm; HelpURL: \\cern.ch\dfs\Applications\Altium\Datasheets\R0805_VISHAY_CRCW e3.pdf; Author: CERN DEM HF; CreateDate: 07.06.2024; LatestRevisionDate: 07.06.2024
R94 = R0805_5R1_1%_0.125W_100PPM: as R86 on sheet FIT_TCM_P1V8; Part Number: R0805_5R1_1%_0.125W_100PPM; Component Kind: Standard; Component Type: Standard; Pin Count: 2; Value: 5R1; Status: None; Manufacturer Part Number: R0805_5R1_1%_0.125W_100PPM; Case: 0805; Mounted: Yes; Sense: No; Socket: No; SMD: Yes; Manufacturer1 Example: VISHAY; Manufacturer1 ComponentHeight: 0.6mm; HelpURL: \\cern.ch\dfs\Applications\Altium\Datasheets\R0805_VISHAY_CRCW-HP e3.pdf; Author: CERN DEM HF; CreateDate: 07.06.2024; LatestRevisionDate: 07.06.2024
R95 R98 = R0805_10K_1%_0.125W_100PPM: as R87 on sheet FIT_TCM_P1V8; Part Number: R0805_10K_1%_0.125W_100PPM; Component Kind: Standard; Component Type: Standard; Pin Count: 2; Value: 10k; Status: Preferred; Manufacturer Part Number: R0805_10K_1%_0.125W_100PPM; Case: 0805; Mounted: Yes; Sense: No; Socket: No; SMD: Yes; Manufacturer1 Example: NIC COMPONENT; Manufacturer1 ComponentHeight: 0.6mm; HelpURL: \\cern.ch\dfs\Applications\Altium\Datasheets\R0805_NIC_NRC.pdf; Author: CERN DEM JLC; CreateDate: 03.12.2007; LatestRevisionDate: 13.03.2008
R96 = R0805_130R_1%_0.125W_100PPM: as R88 on sheet FIT_TCM_P1V8; Part Number: R0805_130R_1%_0.125W_100PPM; Component Kind: Standard; Component Type: Standard; Pin Count: 2; Value: 130; Status: Preferred; Manufacturer Part Number: R0805_130R_1%_0.125W_100PPM; Case: 0805; Mounted: Yes; Sense: No; Socket: No; SMD: Yes; Manufacturer1 Example: NIC COMPONENT; Manufacturer1 ComponentHeight: 0.6mm; HelpURL: \\cern.ch\dfs\Applications\Altium\Datasheets\R0805_NIC_NRC.pdf; Author: CERN DEM JLC; CreateDate: 03.12.2007; LatestRevisionDate: 13.03.2008
R99 = R0805_2K2_1%_0.125W_100PPM: Resistor - 1%; Part Description: General Purpose Thick Film Chip Resistor; Manufacturer: GENERIC; Manufacturer1 Part Number: NRC10F2201TRF; Power: 0.125W; TC: ±100ppm/°C; PressFit: No; Part Number: R0805_2K2_1%_0.125W_100PPM; Component Kind: Standard; Component Type: Standard; Pin Count: 2; Value: 2k2; Status: Preferred; Manufacturer Part Number: R0805_2K2_1%_0.125W_100PPM; Case: 0805; Mounted: Yes; Sense: No; Socket: No; SMD: Yes; Manufacturer1 Example: NIC COMPONENT; Manufacturer1 ComponentHeight: 0.6mm; HelpURL: \\cern.ch\dfs\Applications\Altium\Datasheets\R0805_NIC_NRC.pdf; Author: CERN DEM JLC; CreateDate: 03.12.2007; LatestRevisionDate: 13.03.2008
R110 = R0805_30K_1%_0.125W_100PPM: Resistor - 1%; Part Description: General Purpose Thick Film Chip Resistor; Manufacturer: GENERIC; Manufacturer1 Part Number: NRC10F3002TRF; Power: 0.125W; TC: ±100ppm/°C; PressFit: No; Part Number: R0805_30K_1%_0.125W_100PPM; Component Kind: Standard; Component Type: Standard; Pin Count: 2; Value: 30k; Status: Preferred; Manufacturer Part Number: R0805_30K_1%_0.125W_100PPM; Case: 0805; Mounted: Yes; Sense: No; Socket: No; SMD: Yes; Manufacturer1 Example: NIC COMPONENT; Manufacturer1 ComponentHeight: 0.6mm; HelpURL: \\cern.ch\dfs\Applications\Altium\Datasheets\R0805_NIC_NRC.pdf; Author: CERN DEM JLC; CreateDate: 03.12.2007; LatestRevisionDate: 13.03.2008
R111 = R0805_1K3_1%_0.125W_100PPM: Resistor - 1%; Part Description: General Purpose Thick Film Chip Resistor; Manufacturer: GENERIC; Manufacturer1 Part Number: NRC10F1301TRF; Power: 0.125W; TC: ±100ppm/°C; PressFit: No; Part Number: R0805_1K3_1%_0.125W_100PPM; Component Kind: Standard; Component Type: Standard; Pin Count: 2; Value: 1k3; Status: Preferred; Manufacturer Part Number: R0805_1K3_1%_0.125W_100PPM; Case: 0805; Mounted: Yes; Sense: No; Socket: No; SMD: Yes; Manufacturer1 Example: NIC COMPONENT; Manufacturer1 ComponentHeight: 0.6mm; HelpURL: \\cern.ch\dfs\Applications\Altium\Datasheets\R0805_NIC_NRC.pdf; Author: CERN DEM JLC; CreateDate: 03.12.2007; LatestRevisionDate: 13.03.2008
X15 = MOLEX_15-24-9067: Connector 6 Male; Part Description: Mini-Fit BMI Header, Dual Row, Right-Angle, with Snap-in Plastic Peg PCB Lock, 6 Circuits, Gold (Au) Plating; Manufacturer: MOLEX; PressFit: No; Part Number: MOLEX_15-24-9067; Component Kind: Standard; Component Type: Standard; Pin Count: 6; Family: Mini-Fit BMI; Mounted: Yes; Socket: No; SMD: No; Sense: No; Status: None; Manufacturer Part Number: 15-24-9067; ComponentHeight: 15mm; HelpURL: \\cern.ch\dfs\Applications\Altium\Datasheets\MOLEX_15-24-9067.pdf; Author: CERN DEM HF; CreateDate: 06.06.2024; LatestRevisionDate: 06.06.2024

## Sheet FIT_TCM_RJ45.SchDoc: FIT_PM12 board
size 420 x 297 mm; CheckedBy: G.Kasprowicz; Author: INR Moscow; CompanyName: WUT ISE; DrawnBy: M.Podgórski; Organization: WUT ISE; Address1: PW ISE; Address2: Nowowiejska 15/19 00-665 Warsaw; Address3: gkasprow@gmail.com; Revision: 2; SheetNumber: -; SheetTotal: -; ModifiedBy: -; CheckedDate: -; Title2: Title 2; DivGrp: WUT ISE; Designer: INR RAS; ModifiedDate: -; ProjectName: Sensor Box
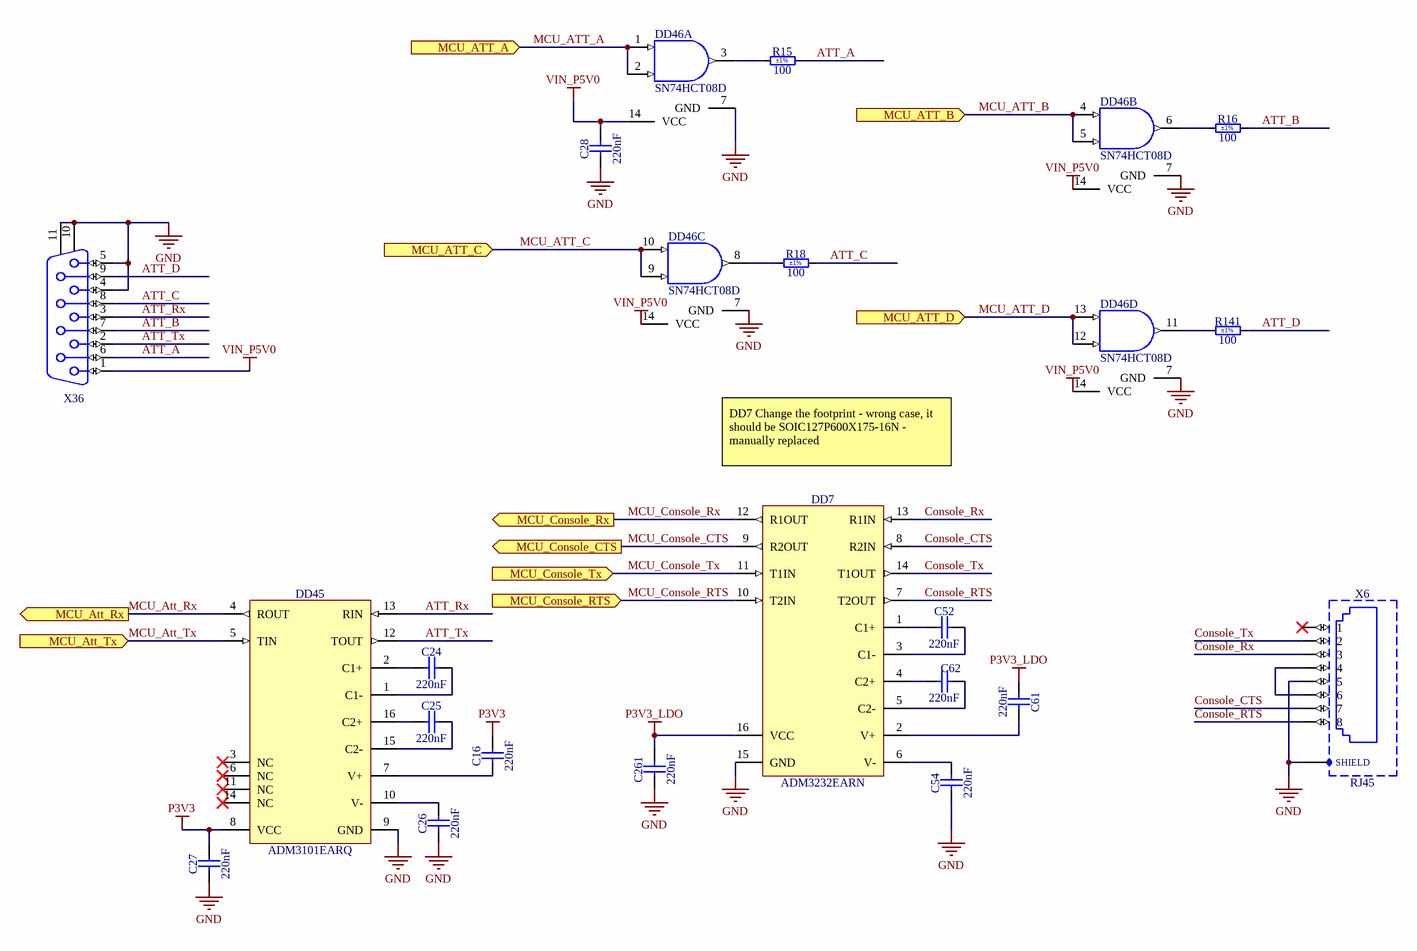
[diagram p11: FIT_TCM_RJ45.SchDoc]

### Parts
C16  220nF  [CAPC2012X135N]
C24  220nF  [CAPC2012X135N]
C25  220nF  [CAPC2012X135N]
C26  220nF  [CAPC2012X135N]
C27  220nF  [CAPC2012X135N]
C28  220nF  [CAPC2012X135N]
C52  220nF  [CAPC2012X135N]
C54  220nF  [CAPC2012X135N]
C61  220nF  [CAPC2012X135N]
C62  220nF  [CAPC2012X135N]
C261  220nF  [CAPC2012X135N]
DD7  ADM3232EARN  [SOIC127P600X175-16N]
DD45  ADM3101EARQ  [SOP63P600X175-16N]
DD46  SN74HCT08D  [SOIC127P600X175-14N]  (parts A,B,C,D of 4)
R15  100  Tolerance: ±1%  [RESC2012X60N]
R16  100  Tolerance: ±1%  [RESC2012X60N]
R18  100  Tolerance: ±1%  [RESC2012X60N]
R141  100  Tolerance: ±1%  [RESC2012X60N]
X6  RJ45  [AMPHENOL_RJLSE4238101]
X36  D-Sub 9F  [HARTING_09 66 152 6612]  (value not drawn)

### Ports
MCU_ATT_A (in), MCU_ATT_B (in), MCU_ATT_C (in), MCU_ATT_D (in), MCU_Att_Rx (out), MCU_Att_Tx (in), MCU_Console_CTS (out), MCU_Console_RTS (in), MCU_Console_Rx (out), MCU_Console_Tx (in)

### Nets
GND: C26.1 C27.1 C28.1 C54.1 C261.1 DD7.15(GND) DD45.9(GND) DD46.7(GND) X6.5 X6.SHIELD X36.4 X36.5 X36.10 X36.11
P3V3: C16.2 C27.2 DD45.8(VCC)
P3V3_LDO: C61.1 C261.2 DD7.16(VCC)
VIN_P5V0: C28.2 DD46.14(VCC) X36.1
ATT_A: R15.2 X36.6
ATT_B: R16.2 X36.7
ATT_C: R18.2 X36.8
ATT_D: R141.2 X36.9
ATT_Rx: DD45.13(RIN) X36.3
ATT_Tx: DD45.12(TOUT) X36.2
Console_CTS: DD7.8(R2IN) X6.7
Console_RTS: DD7.7(T2OUT) X6.8
Console_Rx: DD7.13(R1IN) X6.3
Console_Tx: DD7.14(T1OUT) X6.2
MCU_ATT_A: DD46.1(A) DD46.2(B) ; port MCU_ATT_A
MCU_ATT_B: DD46.4(A) DD46.5(B) ; port MCU_ATT_B
MCU_ATT_C: DD46.9(B) DD46.10(A) ; port MCU_ATT_C
MCU_ATT_D: DD46.12(B) DD46.13(A) ; port MCU_ATT_D
MCU_Att_Rx: DD45.4(ROUT) ; port MCU_Att_Rx
MCU_Att_Tx: DD45.5(TIN) ; port MCU_Att_Tx
MCU_Console_CTS: DD7.9(R2OUT) ; port MCU_Console_CTS
MCU_Console_RTS: DD7.10(T2IN) ; port MCU_Console_RTS
MCU_Console_Rx: DD7.12(R1OUT) ; port MCU_Console_Rx
MCU_Console_Tx: DD7.11(T1IN) ; port MCU_Console_Tx
NetC16_1: C16.1 DD45.7(V+)
NetC24_1: C24.1 DD45.2(C1+)
NetC24_2: C24.2 DD45.1(C1-)
NetC25_1: C25.1 DD45.16(C2+)
NetC25_2: C25.2 DD45.15(C2-)
NetC26_2: C26.2 DD45.10(V-)
NetC52_1: C52.1 DD7.1(C1+)
NetC52_2: C52.2 DD7.3(C1-)
NetC54_2: C54.2 DD7.6(V-)
NetC61_2: C61.2 DD7.2(V+)
NetC62_1: C62.1 DD7.4(C2+)
NetC62_2: C62.2 DD7.5(C2-)
NetDD46_3: DD46.3(Y) R15.1
NetDD46_6: DD46.6(Y) R16.1
NetDD46_8: DD46.8(Y) R18.1
NetDD46_11: DD46.11(Y) R141.1
NetX6_4: X6.4 X6.6

Not connected (* = marked no-connect by the designer): DD45 3(NC)* 6(NC)* 11(NC)* 14(NC)*; X6 1*

### Notes on the sheet
- DD7 Change the footprint - wrong case, it should be SOIC127P600X175-16N - manually replaced
- Project/Equipment
- Document
- Designer
- Drawn by
- Check.by
- Copyright WUT ISE 2024.
  This documentation describes Open Hardware and is licensed under the CERN OHL v.2. You may redistribute and modify this documentation under the terms of the CERN OHL v.2. (http://ohwr.org/CERNOHL). This documentation is distributed WITHOUT ANY EXPRESS OR IMPLIED WARRANTY, INCLUDING OF MERCHANTABILITY, SATISFACTORY QUALITY AND FITNESS FOR A PARTICULAR PURPOSE. Please see the CERN OHL v.2 for applicable conditions.
- Contact
- File
- Last Mod.
- Print Date
- Sheet
- Size
- A3
- of
- Rev

### Library data of the parts
C16 C24-C28 C52 C54 C61 C62 C261 = CC0805_220NF_50V_10%_X7R: as C31-C35 on sheet FIT_TCM_SI5338A; Part Number: CC0805_220NF_50V_10%_X7R; Component Kind: Standard; Component Type: Standard; Pin Count: 2; Value: 220nF; Status: Preferred; Manufacturer Part Number: CC0805_220NF_50V_10%_X7R; Case: 0805; Mounted: Yes; Socket: No; SMD: Yes; Sense: No; Manufacturer1 Example: MURATA; Manufacturer1 ComponentHeight: 1.35mm; HelpURL: \\cern.ch\dfs\Applications\Altium\Datasheets\CC0805_X7R_MURATA.pdf; Author: CERN DEM JLC; CreateDate: 03.12.2007; LatestRevisionDate: 03.12.2007
DD7 = ADM3232EARN: ±15 kV ESD Protected, 3.3 V, RS-232 Line Driver/Receiver; Manufacturer: ANALOG DEVICES; PressFit: No; Bonding: No; Part Number: ADM3232EARN; Component Kind: Standard; Component Type: Standard; Device: ADM3232EARN; Footprint: SOIC127P1032X265-16N; PackageDescription: SOIC, 1.27mm Pitch; 16 pin, 7.50mm W X 10.4mm L X 2.65mm H body, IPC Medium Density; Part Description: ±15 kV ESD Protected, 3.3 V, RS-232 Line Driver/Receiver; Manufacturer Part Number: ADM3232EARN; Pin Count: 16; Case: SOIC16; Mounted: Yes; Socket: No; SMD: Yes; Sense: No; ComponentHeight: 2.65mm; Author: CERN DEM HF; HelpURL: \\cern.ch\dfs\Applications\Altium\Datasheets\ADM3232EARN.pdf; CreateDate: 24.05.2024; LatestRevisionDate: 24.05.2024
DD45 = ADM3101EARQ: ±15 kV ESD Protected, 3.3 V Single-Channel RS-232 Line Driver/Receiver; Manufacturer: ANALOG DEVICES; PressFit: No; Bonding: No; Part Number: ADM3101EARQ; Component Kind: Standard; Component Type: Standard; Device: ADM3101EARQ; PackageDescription: SOP, 0.635mm Pitch; 16 Pin, 3.9mm W X 4.895mm L X 1.75mm H body, IPC Medium Density; Part Description: ±15 kV ESD Protected, 3.3 V Single-Channel RS-232 Line Driver/Receiver; Manufacturer Part Number: ADM3101EARQ; Pin Count: 16; Case: SSOP16; Mounted: Yes; Socket: No; SMD: Yes; Sense: No; ComponentHeight: 1.75mm; Author: CERN DEM HF; HelpURL: \\cern.ch\dfs\Applications\Altium\Datasheets\ADM3101EARQ.pdf; CreateDate: 08.05.2024; LatestRevisionDate: 08.05.2024
DD46 = SN74HCT08D: Quad 2-Input AND Gate; Part Description: Quadruple 2-Input Positive-AND Gate; Manufacturer: TEXAS INSTRUMENTS; PressFit: No; Bonding: No; Part Number: SN74HCT08D; Component Kind: Standard; Component Type: Standard; Device: SN74HCT08D; PackageDescription: SOIC, 1.27mm Pitch; 14 Pin, 4.00mm W X 8.75mm L X 1.75mm H body, IPC Medium Density; Manufacturer Part Number: SN74HCT08D; Pin Count: 14; Case: SOIC14; Mounted: Yes; Socket: No; SMD: Yes; Sense: No; ComponentHeight: 1.75mm; Author: CERN DEM HF; HelpURL: \\cern.ch\dfs\Applications\Altium\Datasheets\SN74HCT08.pdf; CreateDate: 10.06.2024; LatestRevisionDate: 10.06.2024
R15 R16 R18 R141 = R0805_100R_1%_0.125W_100PPM: Resistor - 1%; Part Description: General Purpose Thick Film Chip Resistor; Manufacturer: GENERIC; Manufacturer1 Part Number: NRC10F4700TRF; Power: 0.125W; TC: ±100ppm/°C; PressFit: No; Part Number: R0805_100R_1%_0.125W_100PPM; Component Kind: Standard; Component Type: Standard; Pin Count: 2; Value: 100; Status: Preferred; Manufacturer Part Number: R0805_100R_1%_0.125W_100PPM; Case: 0805; Mounted: Yes; Sense: No; Socket: No; SMD: Yes; Manufacturer1 Example: NIC COMPONENT; Manufacturer1 ComponentHeight: 0.6mm; HelpURL: \\cern.ch\dfs\Applications\Altium\Datasheets\R0805_NIC_NRC.pdf; Author: CERN DEM JLC; CreateDate: 03.12.2007; LatestRevisionDate: 13.03.2008
X6 = AMPHENOL_RJLSE4238101: Connector RJ45 + Shield; Part Description: 1 Port RJ45 Connector, 8P8C ,  Right Angle Without Leds; PressFit: No; Part Number: AMPHENOL_RJLSE4238101; Component Kind: Standard; Component Type: Standard; Pin Count: 9; Family: RJ45; Mounted: Yes; Socket: No; SMD: No; Sense: No; Status: None; Manufacturer: AMPHENOL; Manufacturer Part Number: RJLSE4238101; ComponentHeight: 11.85mm; HelpURL: \\cern.ch\dfs\Applications\Altium\Datasheets\AMPHENOL_RJLSE4238101.pdf; Author: CERN DEM HF; CreateDate: 07.06.2024; LatestRevisionDate: 07.06.2024
X36 = HARTING_09 66 152 6612: Connector D-sub 9 Female; Part Description: Right Angled D-Sub 9 Female Contacts with Grounding Board Locks And UNC 4-40 Flange Thread; PressFit: No; Part Number: HARTING_09 66 152 6612; Component Kind: Standard; Component Type: Standard; Pin Count: 11; Family: D-Sub 9F; Mounted: Yes; Socket: No; SMD: No; Sense: No; Status: None; Manufacturer: HARTING; Manufacturer Part Number: 09 66 152 6612; ComponentHeight: 13.6mm; HelpURL: \\cern.ch\dfs\Applications\Altium\Datasheets\HARTING_09 66 152 6612.pdf; Author: CERN DEM JLC; CreateDate: 16.12.2010; LatestRevisionDate: 08.04.2013

## Sheet FIT_TCM_SFP_PLUS.SchDoc: FIT_PM12 board
size 420 x 297 mm; CheckedBy: G.Kasprowicz; Author: INR Moscow; CompanyName: WUT ISE; DrawnBy: M.Podgórski; Organization: WUT ISE; Address1: PW ISE; Address2: Nowowiejska 15/19 00-665 Warsaw; Address3: gkasprow@gmail.com; Revision: 2; SheetNumber: -; SheetTotal: -; ModifiedBy: -; CheckedDate: -; Title2: Title 2; DivGrp: WUT ISE; Designer: INR RAS; ModifiedDate: -; ProjectName: Sensor Box
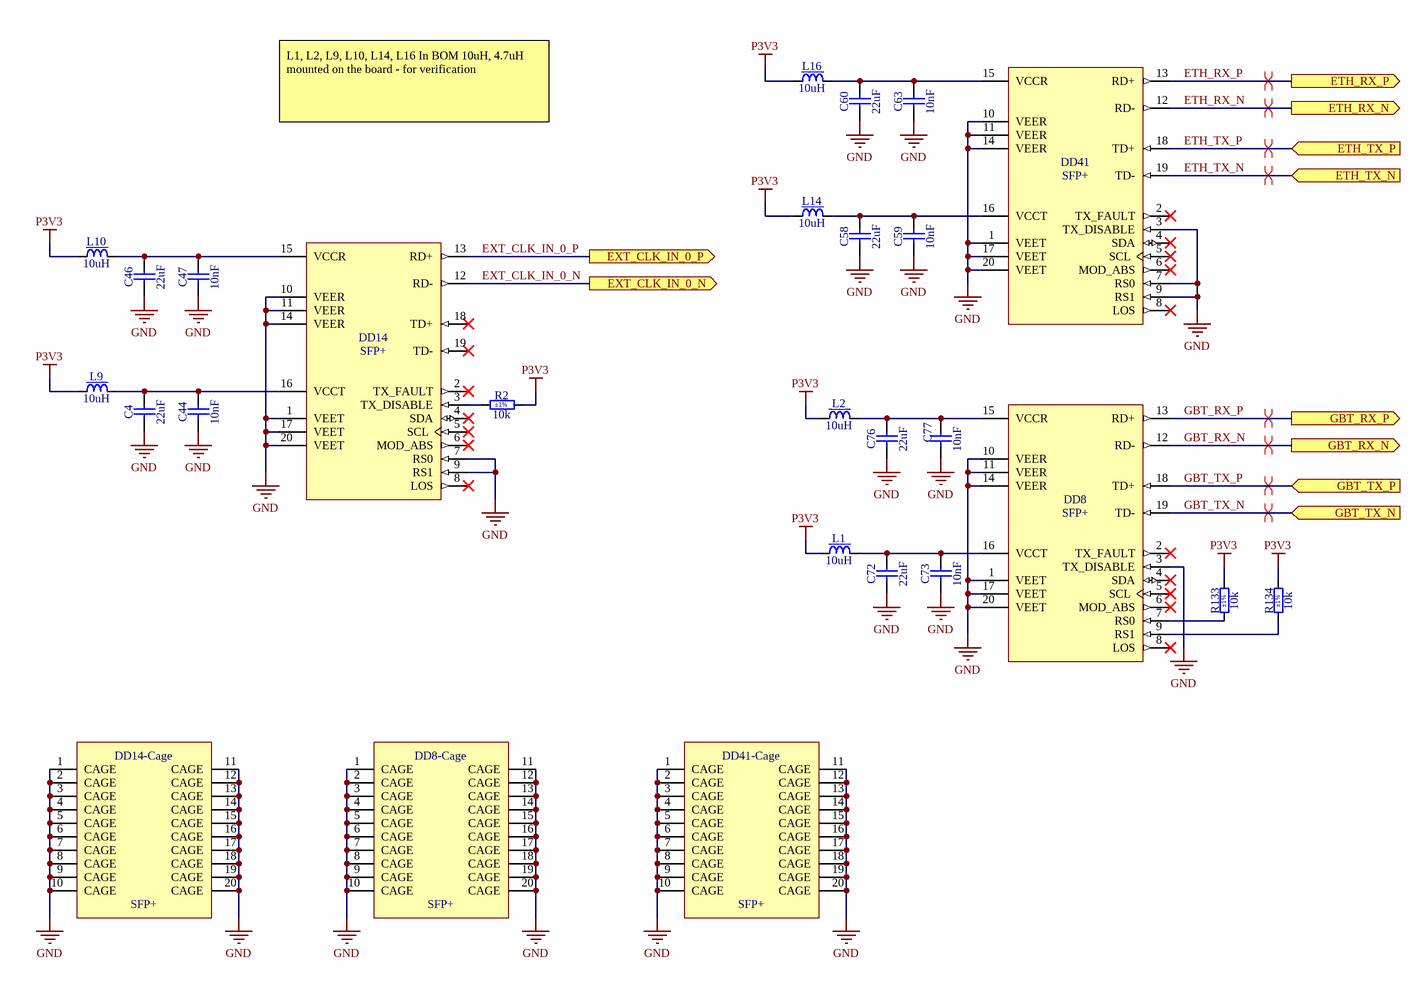
[diagram p12: FIT_TCM_SFP_PLUS.SchDoc]

### Parts
C4  22uF  [CAPC3216X180N]
C44  10nF  [CAPC2012X135N]
C46  22uF  [CAPC3216X180N]
C47  10nF  [CAPC2012X135N]
C58  22uF  [CAPC3216X180N]
C59  10nF  [CAPC2012X135N]
C60  22uF  [CAPC3216X180N]
C63  10nF  [CAPC2012X135N]
C72  22uF  [CAPC3216X180N]
C73  10nF  [CAPC2012X135N]
C76  22uF  [CAPC3216X180N]
C77  10nF  [CAPC2012X135N]
DD8  SFP+  [AMPHENOL_UE76A203000]
DD8-Cage  SFP+  [AMPHENOL_U77A16131001]
DD14  SFP+  [AMPHENOL_UE76A203000]
DD14-Cage  SFP+  [AMPHENOL_U77A16131001]
DD41  SFP+  [AMPHENOL_UE76A203000]
DD41-Cage  SFP+  [AMPHENOL_U77A16131001]
L1  10uH  [INDM5552X200N]
L2  10uH  [INDM5552X200N]
L9  10uH  [INDM5552X200N]
L10  10uH  [INDM5552X200N]
L14  10uH  [INDM5552X200N]
L16  10uH  [INDM5552X200N]
R2  10k  Tolerance: ±1%  [RESC2012X60N]
R133  10k  Tolerance: ±1%  [RESC2012X60N]
R134  10k  Tolerance: ±1%  [RESC2012X60N]

### Ports
ETH_RX_N (out), ETH_RX_P (out), ETH_TX_N (in), ETH_TX_P (in), EXT_CLK_IN_0_N (out), EXT_CLK_IN_0_P (out), GBT_RX_N (out), GBT_RX_P (out), GBT_TX_N (in), GBT_TX_P (in)

### Nets
GND: C4.1 C44.1 C46.1 C47.1 C58.1 C59.1 C60.1 C63.1 C72.1 C73.1 C76.1 C77.1 DD8.1(VEET) DD8.3(TX_DISABLE) DD8.10(VEER) DD8.11(VEER) DD8.14(VEER) DD8.17(VEET) DD8.20(VEET) DD8-Cage.1(CAGE) DD8-Cage.2(CAGE) DD8-Cage.3(CAGE) DD8-Cage.4(CAGE) DD8-Cage.5(CAGE) DD8-Cage.6(CAGE) DD8-Cage.7(CAGE) DD8-Cage.8(CAGE) DD8-Cage.9(CAGE) DD8-Cage.10(CAGE) DD8-Cage.11(CAGE) DD8-Cage.12(CAGE) DD8-Cage.13(CAGE) DD8-Cage.14(CAGE) DD8-Cage.15(CAGE) DD8-Cage.16(CAGE) DD8-Cage.17(CAGE) DD8-Cage.18(CAGE) DD8-Cage.19(CAGE) DD8-Cage.20(CAGE) DD14.1(VEET) DD14.7(RS0) DD14.9(RS1) DD14.10(VEER) DD14.11(VEER) DD14.14(VEER) DD14.17(VEET) DD14.20(VEET) DD14-Cage.1(CAGE) DD14-Cage.2(CAGE) DD14-Cage.3(CAGE) DD14-Cage.4(CAGE) DD14-Cage.5(CAGE) DD14-Cage.6(CAGE) DD14-Cage.7(CAGE) DD14-Cage.8(CAGE) DD14-Cage.9(CAGE) DD14-Cage.10(CAGE) DD14-Cage.11(CAGE) DD14-Cage.12(CAGE) DD14-Cage.13(CAGE) DD14-Cage.14(CAGE) DD14-Cage.15(CAGE) DD14-Cage.16(CAGE) DD14-Cage.17(CAGE) DD14-Cage.18(CAGE) DD14-Cage.19(CAGE) DD14-Cage.20(CAGE) DD41.1(VEET) DD41.3(TX_DISABLE) DD41.7(RS0) DD41.9(RS1) DD41.10(VEER) DD41.11(VEER) DD41.14(VEER) DD41.17(VEET) DD41.20(VEET) DD41-Cage.1(CAGE) DD41-Cage.2(CAGE) DD41-Cage.3(CAGE) DD41-Cage.4(CAGE) DD41-Cage.5(CAGE) DD41-Cage.6(CAGE) DD41-Cage.7(CAGE) DD41-Cage.8(CAGE) DD41-Cage.9(CAGE) DD41-Cage.10(CAGE) DD41-Cage.11(CAGE) DD41-Cage.12(CAGE) DD41-Cage.13(CAGE) DD41-Cage.14(CAGE) DD41-Cage.15(CAGE) DD41-Cage.16(CAGE) DD41-Cage.17(CAGE) DD41-Cage.18(CAGE) DD41-Cage.19(CAGE) DD41-Cage.20(CAGE)
P3V3: L1.1 L2.1 L9.1 L10.1 L14.1 L16.1 R2.2 R133.2 R134.2
ETH_RX_N: DD41.12(RD-) ; port ETH_RX_N
ETH_RX_P: DD41.13(RD+) ; port ETH_RX_P
ETH_TX_N: DD41.19(TD-) ; port ETH_TX_N
ETH_TX_P: DD41.18(TD+) ; port ETH_TX_P
EXT_CLK_IN_0_N: DD14.12(RD-) ; port EXT_CLK_IN_0_N
EXT_CLK_IN_0_P: DD14.13(RD+) ; port EXT_CLK_IN_0_P
GBT_RX_N: DD8.12(RD-) ; port GBT_RX_N
GBT_RX_P: DD8.13(RD+) ; port GBT_RX_P
GBT_TX_N: DD8.19(TD-) ; port GBT_TX_N
GBT_TX_P: DD8.18(TD+) ; port GBT_TX_P
NetC4_2: C4.2 C44.2 DD14.16(VCCT) L9.2
NetC46_2: C46.2 C47.2 DD14.15(VCCR) L10.2
NetC58_2: C58.2 C59.2 DD41.16(VCCT) L14.2
NetC60_2: C60.2 C63.2 DD41.15(VCCR) L16.2
NetC72_2: C72.2 C73.2 DD8.16(VCCT) L1.2
NetC76_2: C76.2 C77.2 DD8.15(VCCR) L2.2
NetDD8_7: DD8.7(RS0) R133.1
NetDD8_9: DD8.9(RS1) R134.1
NetDD14_3: DD14.3(TX_DISABLE) R2.1

Not connected (* = marked no-connect by the designer): DD8 2(TX_FAULT)* 4(SDA)* 5(SCL)* 6(MOD_ABS)* 8(LOS)*; DD14 2(TX_FAULT)* 4(SDA)* 5(SCL)* 6(MOD_ABS)* 8(LOS)* 18(TD+)* 19(TD-)*; DD41 2(TX_FAULT)* 4(SDA)* 5(SCL)* 6(MOD_ABS)* 8(LOS)*

### Layout directives
differential pair: ETH_RX_N, ETH_RX_P, ETH_TX_N, ETH_TX_P, GBT_RX_N, GBT_RX_P, GBT_TX_N, GBT_TX_P

### Notes on the sheet
- L1, L2, L9, L10, L14, L16 In BOM 10uH, 4.7uH mounted on the board - for verification
- Project/Equipment
- Document
- Designer
- Drawn by
- Check.by
- Copyright WUT ISE 2024.
  This documentation describes Open Hardware and is licensed under the CERN OHL v.2. You may redistribute and modify this documentation under the terms of the CERN OHL v.2. (http://ohwr.org/CERNOHL). This documentation is distributed WITHOUT ANY EXPRESS OR IMPLIED WARRANTY, INCLUDING OF MERCHANTABILITY, SATISFACTORY QUALITY AND FITNESS FOR A PARTICULAR PURPOSE. Please see the CERN OHL v.2 for applicable conditions.
- Contact
- File
- Last Mod.
- Print Date
- Sheet
- Size
- A3
- of
- Rev

### Library data of the parts
C4 C46 C58 C60 C72 C76 = CC1206_22UF_25V_20%_X5R: Non-polarised capacitor; Part Description: SMD Multilayer Chip Ceramic Capacitor; Manufacturer: GENERIC; Manufacturer1 Part Number: C3216X5R1E226M160; Voltage: 25V; TC: X5R; Tolerance: ±20%; Part Number: CC1206_22UF_25V_20%_X5R; Component Kind: Standard; Component Type: Standard; Pin Count: 2; Value: 22uF; Status: None; Manufacturer Part Number: CC1206_22UF_25V_20%_X5R; Case: 1206; Mounted: Yes; Socket: No; SMD: Yes; Sense: No; Manufacturer1 Example: TDK; Manufacturer1 ComponentHeight: 1.8mm; HelpURL: \\cern.ch\dfs\Applications\Altium\Datasheets\CC1206_X5R_TDK_C.pdf; Author: CERN DEM WB; CreateDate: 25.07.2018; LatestRevisionDate: 25.07.2018
C44 C47 C59 C63 C73 C77 = CC0805_10NF_50V_10%_X7R: as C178 on sheet FIT_TCM_P1V8; Part Number: CC0805_10NF_50V_10%_X7R; Component Kind: Standard; Component Type: Standard; Pin Count: 2; Value: 10nF; Status: Preferred; Manufacturer Part Number: CC0805_10NF_50V_10%_X7R; Case: 0805; Mounted: Yes; Socket: No; SMD: Yes; Sense: No; Manufacturer1 Example: KEMET; Manufacturer1 ComponentHeight: 0.88mm; HelpURL: \\cern.ch\dfs\Applications\Altium\Datasheets\CC0805_X7R_KEMET.pdf; Author: CERN DEM JLC; CreateDate: 03.12.2007; LatestRevisionDate: 22.04.2015
DD8 DD14 DD41 = AMPHENOL_UE76A203000: 20 Position SFP+ Connector (Small Form-factor Pluggable); Part Description: 20 Position, Pitch 0.8mm SFP+ High Speed Connector Receptacle (Small Form-factor Pluggable); PressFit: No; Part Number: AMPHENOL_UE76A203000; Component Kind: Standard; Component Type: Standard; Pin Count: 20; Family: SFP+; Mounted: Yes; Socket: No; SMD: Yes; Sense: No; Status: None; Manufacturer: AMPHENOL; Manufacturer Part Number: UE76A203000; ComponentHeight: 5.25mm; HelpURL: \\cern.ch\dfs\Applications\Altium\Datasheets\AMPHENOL_UE76A203000.pdf; Author: CERN DEM BC; CreateDate: 04.09.2020; LatestRevisionDate: 04.09.2020
DD8-Cage DD14-Cage DD41-Cage = AMPHENOL_U77A16131001: SFP+ 1x1 Cage (20Pins); Part Description: 1x1 Cage For Use with SFP+ Connector (Small Form-factor Pluggable); PressFit: No; Part Number: AMPHENOL_U77A16131001; Component Kind: Standard; Component Type: Standard; Pin Count: 20; Family: SFP+; Mounted: Yes; Socket: No; SMD: No; Sense: No; Status: None; Manufacturer: AMPHENOL; Manufacturer Part Number: U77A16131001; ComponentHeight: 9.7mm; HelpURL: \\cern.ch\dfs\Applications\Altium\Datasheets\AMPHENOL_U77A16131001.pdf; Author: CERN DEM BC; CreateDate: 03.09.2020; LatestRevisionDate: 03.09.2020
L1 L2 L9 L10 L14 L16 = IND2020_10UH_20%_VISHAY_IHLP-2020BZ-11: Inductor With Core; Part Description: Low Profile, High Current IHLP® Inductor; Manufacturer: VISHAY DALE; Manufacturer Part Number: IHLP2020BZER100M11; Power: 2.2A; Resistance: 0.1828R; Tolerance: ±20%; Part Number: IND2020_10UH_20%_VISHAY_IHLP-2020BZ-11; Component Kind: Standard; Component Type: Standard; Pin Count: 2; Value: 10uH; Case: 2020; Mounted: Yes; Socket: No; SMD: Yes; Sense: No; ComponentHeight: 2mm; HelpURL: \\cern.ch\dfs\Applications\Altium\Datasheets\IND2020_VISHAY_IHLP2020BZ-11.pdf; Author: CERN DEM HF; CreateDate: 31.05.2024; LatestRevisionDate: 31.05.2024
R2 R133 R134 = R0805_10K_1%_0.125W_100PPM: as R87 on sheet FIT_TCM_P1V8; Part Number: R0805_10K_1%_0.125W_100PPM; Component Kind: Standard; Component Type: Standard; Pin Count: 2; Value: 10k; Status: Preferred; Manufacturer Part Number: R0805_10K_1%_0.125W_100PPM; Case: 0805; Mounted: Yes; Sense: No; Socket: No; SMD: Yes; Manufacturer1 Example: NIC COMPONENT; Manufacturer1 ComponentHeight: 0.6mm; HelpURL: \\cern.ch\dfs\Applications\Altium\Datasheets\R0805_NIC_NRC.pdf; Author: CERN DEM JLC; CreateDate: 03.12.2007; LatestRevisionDate: 13.03.2008